# EAGLE design tiltcontrol (EAGLE 6.0)
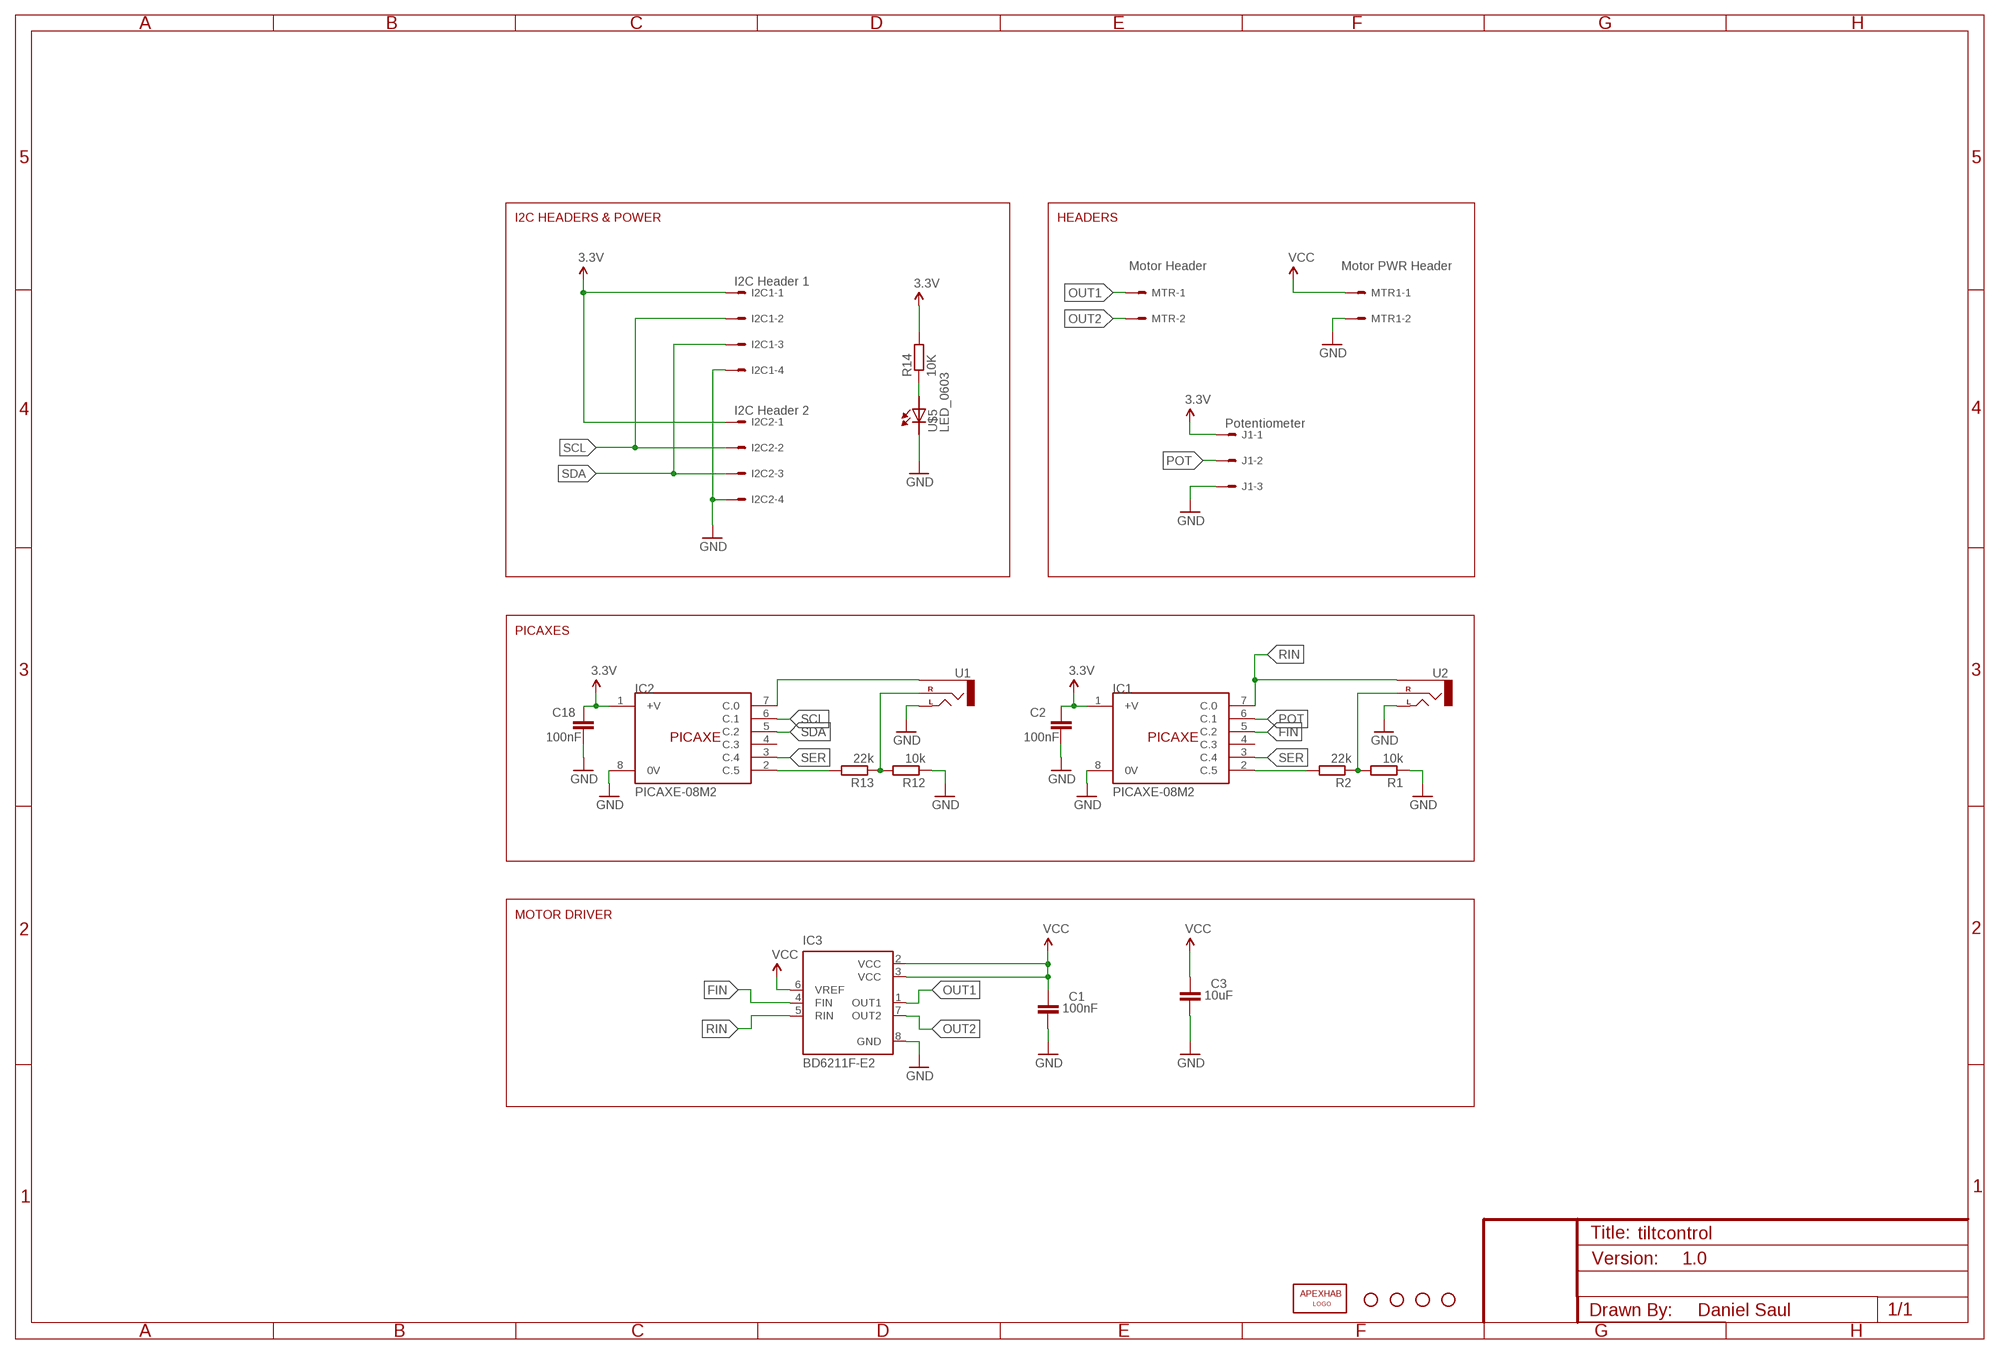
[diagram p0: schematic, sheet 1]

## Parts
C1  100nF  C-EUC0805  [C0805]
C2  100nF  C-EUC0805  [C0805]
C3  10uF  C-EUC0805  [C0805]
C18  100nF  C-EUC0805  [C0805]
I2C1  I2C Header 1  22-27-2041-04  [6410-04]
I2C2  I2C Header 2  22-27-2041-04  [6410-04]
IC1  PICAXE-08M2  [SOIC8]
IC2  PICAXE-08M2  [SOIC8]
IC3  BD6211F-E2  BD6230F  [SOP8]
J1  Potentiometer  22-27-2031-03  [6410-03]
JP1  APEXHAB-LOGO_APEXHAB-SMALL  [APEXHAB-LOGO-SMALL]
JP2  STAND-OFF  [STAND-OFF]
JP3  STAND-OFF  [STAND-OFF]
JP4  STAND-OFF  [STAND-OFF]
JP5  STAND-OFF  [STAND-OFF]
MTR  Motor Header  22-27-2021-02  [6410-02]
MTR1  Motor PWR Header  22-27-2021-02  [6410-02]
R1  10k  R-EU_R0805  [R0805]
R2  22k  R-EU_R0805  [R0805]
R12  10k  R-EU_R0805  [R0805]
R13  22k  R-EU_R0805  [R0805]
R14  10K  R-EU_R0805  [R0805]
U1  AUDIO-JACKPTH  [AUDIO-JACK]
U2  AUDIO-JACKPTH  [AUDIO-JACK]
U$5  LED_0603  [CHIPLED_0603]

## Nets
3.3V: C2.1 C18.1 I2C1.1 I2C2.1 IC1.1(+V) IC2.1(+V) J1.1 R14.2
FIN: IC1.5(C.2) IC3.4(FIN)
GND: C1.2 C2.2 C3.2 C18.2 I2C1.4 I2C2.4 IC1.8(0V) IC2.8(0V) IC3.8(GND) J1.3 MTR1.2 R1.1 R12.1 U1.TIP(LEFT) U2.TIP(LEFT) U$5.C
N$2: IC1.2(C.5) R2.2
N$3: R1.2 R2.1 U2.RING(RIGHT)
N$17: IC2.2(C.5) R13.2
N$18: IC2.7(C.0) U1.SLEEVE
N$20: R12.2 R13.1 U1.RING(RIGHT)
N$21: R14.1 U$5.A
OUT1: IC3.1(OUT1) MTR.1
OUT2: IC3.7(OUT2) MTR.2
POT: IC1.6(C.1) J1.2
RIN: IC1.7(C.0) IC3.5(RIN) U2.SLEEVE
SCL: I2C1.2 I2C2.2 IC2.6(C.1)
SDA: I2C1.3 I2C2.3 IC2.5(C.2)
SER: IC1.3(C.4) IC2.3(C.4)
VCC: C1.1 C3.1 IC3.2(VCC) IC3.3(VCC) IC3.6(VREF) MTR1.1
Unconnected: IC1.4(C.3) IC2.4(C.3)

## Notes on the sheet
- I2C HEADERS & POWER | HEADERS
- PICAXES
- MOTOR DRIVER
- 1.0
- Daniel Saul

## Library data of the parts
C1-C3 C18 = rcl:C-EU: CAPACITOR, European symbol
I2C1 I2C2 = apex:22-?-04: CONNECTOR wire to board 2.54 mm (.1 inch) pitch header; OC_FARNELL: unknown; OC_NEWARK: unknown
IC1 IC2 = apex:PICAXE-08M2
IC3 = rohm:BD623*F: H-bridge driver for brush motors Source: http://www.rohm.com/products/databook/motor/pdf/bd623x_series-e.pdf; MPN: BD6230F-E2; OC_FARNELL: 1716264; OC_NEWARK: 15R0529
J1 = apex:22-?-03: CONNECTOR wire to board 2.54 mm (.1 inch) pitch header; OC_FARNELL: unknown; OC_NEWARK: unknown
JP1 = apex:APEXHAB-LOGO: ApexHAB PCB Logo This is the standard ApexHAB PCB logo.
JP2-JP5 = apex:STAND-OFF: Stand Off This is the mechanical footprint for a #4 phillips button head screw. Use the keepout ring to avoid running the screw head into surrounding components. SKU : PRT-00447
MTR MTR1 = apex:22-?-02: CONNECTOR wire to board 2.54 mm (.1 inch) pitch header; OC_FARNELL: unknown; OC_NEWARK: unknown
R1 R2 R12-R14 = rcl:R-EU_: RESISTOR, European symbol
U1 U2 = SparkFun:AUDIO-JACK: 3.5mm Audio Jack Simple 3.5mm common PCB mount audio jack. SKU: PRT-08032
U$5 = apex:LED: SMD LED

## Board
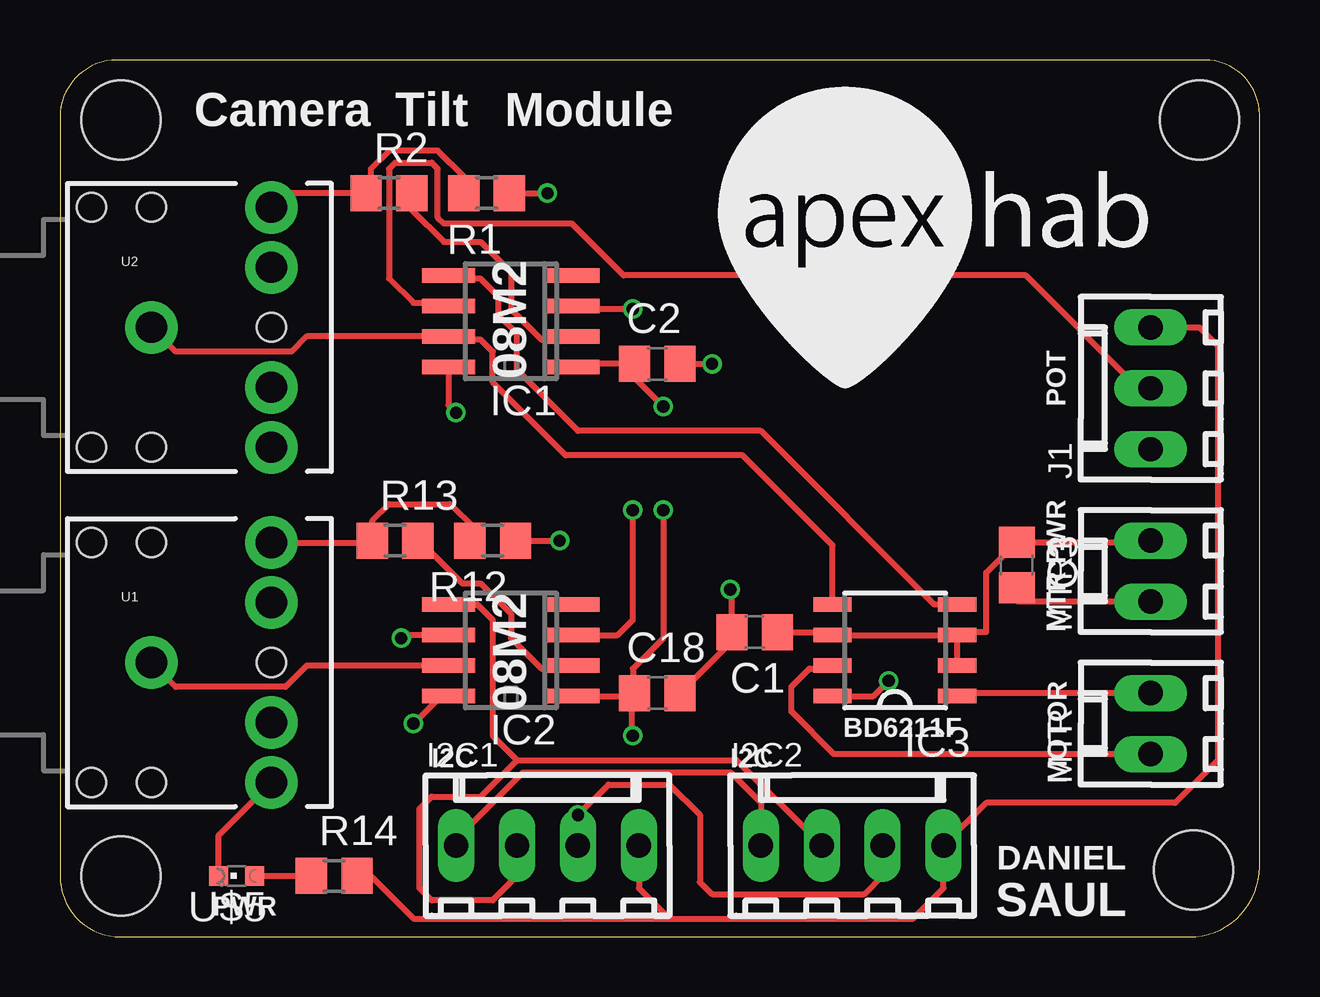
[diagram p1: board, top side]
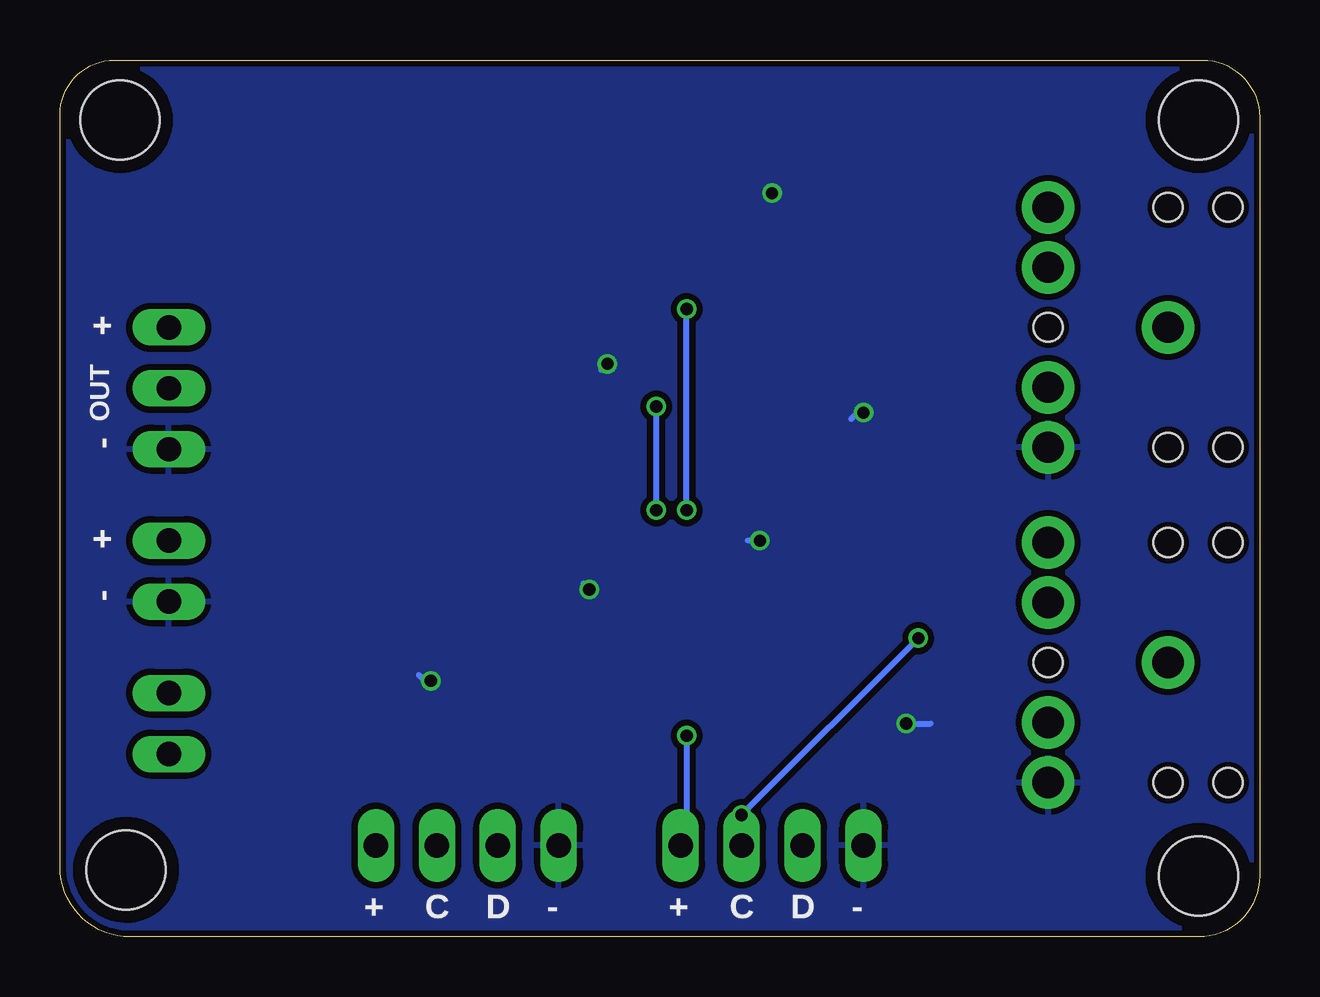
[diagram p2: board, bottom side, seen from below]

Size 50 x 36.54 mm. Coordinates in mm from the lower left corner, seen from the top.
Outline: 0,34.16 0,2.54 arc90 2.54,0 47.07,0 arc90 50,2.93 50,34.25 arc90 47.71,36.54 2.38,36.54 arc90 0,34.16
Copper layers (1*16): Top 0.035mm / dielectric 1.5mm / Bottom 0.035mm
Design rules: minimum track width 6mil, minimum drill 12mil, track to track 6mil, track to pad 6mil, pad to pad 6mil, via to via 6mil, smd to smd 0mil, copper to edge 10mil, drill to drill 10mil, minimum pad ring 10mil, minimum via ring 6mil, stop-mask expansion 2mil, vias tented up to drill 100mil, thermal gap 10mil

### Footprints (pad centres in the part's own frame; a part is rotated, then mirrored left to right if it is on the bottom)
C0805 = smd 1.3 x 1.5: 1 -0.95,0; 2 0.95,0
6410-04 = drill 1.016 long: 1 3.81,0; 2 1.27,0; 3 -1.27,0; 4 -3.81,0
SOIC8 = smd 0.6 x 2.2: 1 -1.905,-2.6; 2 -0.635,-2.6; 3 0.635,-2.6; 4 1.905,-2.6; 5 1.905,2.6; 6 0.635,2.6; 7 -0.635,2.6; 8 -1.905,2.6
SOP8 = smd 0.6 x 1.6: 1 -1.905,-2.6; 2 -0.635,-2.6; 3 0.635,-2.6; 4 1.905,-2.6; 5 1.905,2.6; 6 0.635,2.6; 7 -0.635,2.6; 8 -1.905,2.6
6410-03 = drill 1.016 long: 1 2.54,0; 2 0,0; 3 -2.54,0
STAND-OFF = hole 3.302: 0,0
6410-02 = drill 1.016 long: 1 1.27,0; 2 -1.27,0
R0805 = smd 1.3 x 1.5: 1 -0.95,0; 2 0.95,0
AUDIO-JACK = drill 1.3 pad 2.184: RING 5,5; RSH 5,2.5; SLEEVE 0,0; TIP 5,-5; TSH 5,-2.5 | hole 1.2: 0,5; -2.5,5; -2.5,-5; 0,-5; 5,0
CHIPLED_0603 = smd 0.8 x 0.8: A 0,-0.75; C 0,0.75

### Placement (x,y rotation side)
C1  28.96,12.7 180 top
C2  24.89,23.88 0 top
C3  39.88,15.49 270 top
C18  24.89,10.16 0 top
I2C1  20.32,3.81 0 top
I2C2  33.02,3.81 0 top
IC1  18.8,25.65 90 top
IC2  18.8,11.94 90 top
IC3  34.8,11.94 90 top
J1  45.47,22.86 90 top
JP1  27.43,22.86 0 top
JP2  2.54,2.54 0 top
JP3  47.5,34.04 0 top
JP4  2.54,34.04 0 top
JP5  47.24,2.79 0 top
MTR  45.47,8.89 90 top
MTR1  45.47,15.24 90 top
R1  17.78,30.99 180 top
R2  13.72,30.99 0 top
R12  18.03,16.51 180 top
R13  13.97,16.51 0 top
R14  11.43,2.54 0 top
U1  3.81,11.43 0 top
U2  3.81,25.4 0 top
U$5  7.37,2.54 90 top

### Tracks (layer width: path | path; a pad name or v marks a point on that pad's centre or on a via)
3.3V  (via drill 0.51)
  Top 0.254: I2C1.1 24.13,2.03 25.4,0.76 | 25.4,0.76 35.56,0.76 36.83,2.03 I2C2.1 38.61,5.59 46.48,5.59 48.26,7.37 48.26,24.64 47.5,25.4 J1.1 | 25.4,0.76 14.73,0.76 12.95,2.54 R14.2 12.7,2.86 | IC2.1 23.82,10.03 | 23.82,10.03 C18.1 23.88,10.23 23.88,11.18 25.15,12.45 v25.15,17.78 | IC1.1 21.52,23.88 C2.1 23.94,23.3 v25.15,22.1 | 23.82,10.03 23.82,8.44 v23.88,8.38
  Bottom 0.254: v25.15,22.1 v25.15,17.78 | v23.88,8.38 23.88,4.06 I2C1.1
FIN
  Top 0.254: IC3.4 36.45,13.84 29.21,21.08 21.59,21.08 19.05,23.62 19.05,25.15 18.29,25.91 18.29,26.67 17.53,27.43 16.32,27.43 IC1.5
GND  (via drill 0.51)
  Top 0.254: I2C1.4 16.51,4.06 19.3,6.86 27.94,6.86 29.21,5.59 I2C2.4 | U$5.C 6.62,4.24 U1.TIP | C18.2 28.01,12.32 C1.2 28.01,14.41 v27.94,14.48 | MTR1.2 39.94,13.97 C3.2 | R1.1 v20.32,30.99 | C2.2 v27.18,23.88 | IC1.8 16.2,22.16 v16.51,21.84 | R12.1 v20.83,16.51 | IC2.8 15.88,10.03 v14.73,8.89 | IC3.8 33.91,10.03 v34.54,10.67
  Bottom 0.254: v20.32,30.99 20.57,30.99 | v27.18,23.88 27.43,23.62 | v16.51,21.84 16.76,21.84 17.02,21.59 | v20.83,16.51 21.34,16.51 | v14.73,8.89 13.72,8.89 | v27.94,14.48 28.19,14.73 | v34.54,10.67 34.8,10.67 35.05,10.92
  pour Bottom (isolate 0.254): 0,36.83 50.8,36.83 50.8,0 0,0
N$2
  Top 0.254: R2.2 14.67,30.29 16,28.96 17.53,28.96 18.8,27.69 18.8,26.16 20.07,24.89 21.27,24.89 IC1.2
N$3
  Top 0.254: R2.1 12.77,31.56 | R2.1 9.4,30.99 U2.RING | R2.1 12.95,31.18 12.95,32 13.72,32.77 15.75,32.77 16.83,31.68 R1.2
N$17
  Top 0.254: R13.2 14.99,16.51 16.76,14.73 17.53,14.73 18.8,13.46 18.8,12.45 20.07,11.18 21.27,11.18 IC2.2
N$18
  Top 0.254: IC2.7 10.29,11.3 9.4,10.41 4.83,10.41 U1.SLEEVE
N$20
  Top 0.254: U1.RING 12.94,16.43 R13.1 13.02,17.34 13.72,18.03 16.26,18.03 17.27,17.02 17.27,16.7 R12.2
N$21
  Top 0.254: U$5.A R14.1
OUT1
  Top 0.254: MTR.1 37.52,10.16 IC3.1
OUT2
  Top 0.254: MTR.2 32.26,7.62 30.48,9.4 30.48,10.41 31.24,11.18 32.07,11.18 IC3.7
POT
  Top 0.254: J1.2 44.7,23.11 40.26,27.56 23.5,27.56 21.34,29.72 16,29.72 15.75,29.97 15.75,32 15.49,32.26 13.97,32.26 13.72,32 13.72,27.43 14.73,26.42 16.07,26.42 IC1.6
RIN
  Top 0.254: IC3.5 32.2,16.32 28.45,20.07 21.08,20.07 18.03,23.11 18.03,24.38 17.53,24.89 16.32,24.89 IC1.7 10.29,25.02 9.65,24.38 4.83,24.38 U2.SLEEVE
SCL  (via drill 0.51)
  Top 0.254: I2C1.2 v21.59,5.08 22.86,6.35 25.4,6.35 26.67,5.08 26.67,2.29 27.18,1.78 33.53,1.78 34.29,2.54 I2C2.2 | IC2.6 14.48,12.57 | 14.48,12.57 14.35,12.57 v14.22,12.45 14.35,12.45 14.48,12.57
  Bottom 0.254: v21.59,5.08 v14.22,12.45
SDA
  Top 0.254: I2C1.3 19.05,2.54 18.03,1.52 15.49,1.52 14.99,2.03 14.99,5.33 15.49,5.84 17.53,5.84 19.05,7.37 | 19.05,7.37 28.19,7.37 I2C2.3 | IC2.5 17.4,13.84 18.03,13.21 18.03,8.38 19.05,7.37
SER  (via drill 0.51)
  Top 0.254: IC2.3 23.24,12.57 23.88,13.21 v23.88,17.78 | v23.88,26.16 21.52,26.16 IC1.3
  Bottom 0.254: v23.88,17.78 v23.88,26.16
VCC
  Top 0.254: IC3.2 IC3.3 | C1.1 32.07,12.7 IC3.6 IC3.3 | IC3.3 37.52,12.7 38.61,12.7 38.61,15.17 C3.1 45.4,16.44 MTR1.1

### Text on the board
tPlace: Camera | Tilt | Module | 08M2 | POT | MTR PWR | MOTOR | 08M2 | BD6211F | I2C | I2C | DANIEL | SAUL | PWR
bPlace: + | OUT | - | + | - | - | D | C | + | - | D | C | +